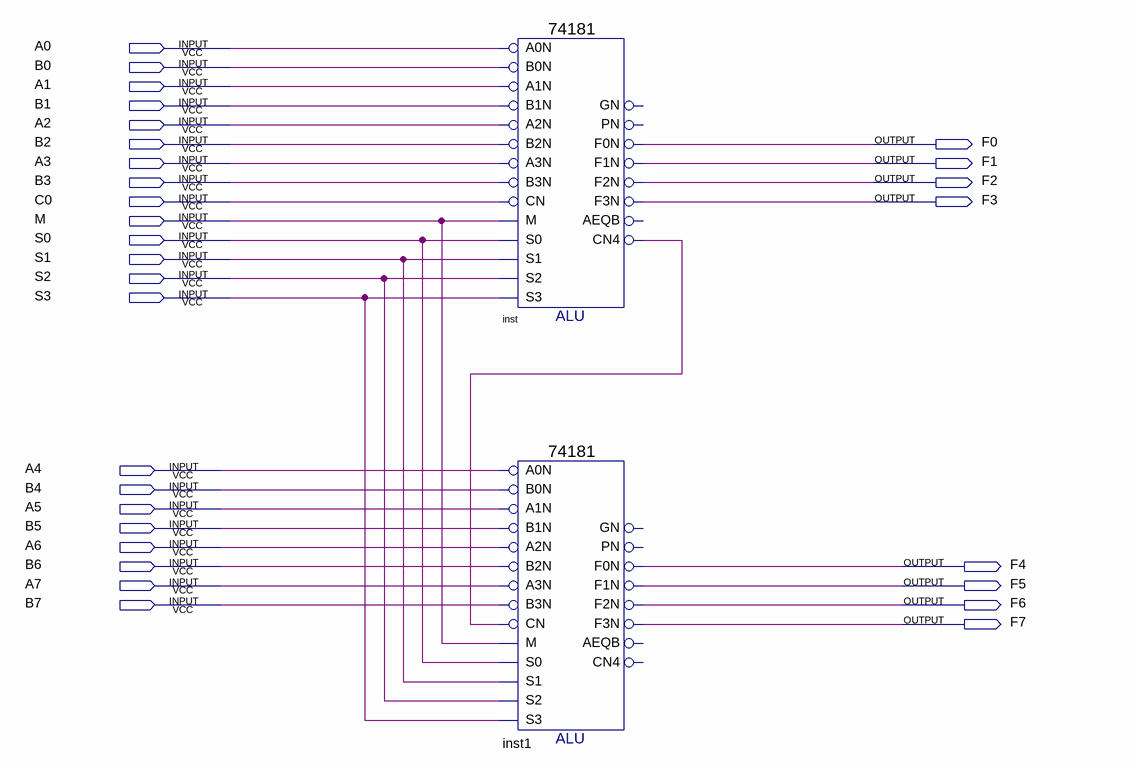
[diagram p0: schematic sheet]
// Quartus schematic alu.bdf as structural Verilog: 2 symbols, 30 pins
module alu (
  input  A0,
  input  B0,
  input  A1,
  input  B1,
  input  A2,
  input  B2,
  input  A3,
  input  B3,
  input  C0,
  input  M,
  input  S0,
  input  S1,
  input  S2,
  input  S3,
  input  A4,
  input  B4,
  input  A5,
  input  B5,
  input  A6,
  input  B6,
  input  A7,
  input  B7,
  output F0,
  output F1,
  output F2,
  output F3,
  output F4,
  output F5,
  output F6,
  output F7
);

  wire inst_cn4;

  \74181  inst (
    .B0N(B0), .A0N(A0), .A1N(A1), .B1N(B1), .A3N(A3), .B2N(B2), .A2N(A2), .M(M), .CN(C0), .B3N(B3), .S2(S2),
    .S1(S1), .S0(S0), .S3(S3), .F3N(F3), .F1N(F1), .F0N(F0), .CN4(inst_cn4), .F2N(F2));  // open: PN, GN, AEQB
  \74181  inst1 (
    .B0N(B4), .A0N(A4), .A1N(A5), .B1N(B5), .A3N(A7), .B2N(B6), .A2N(A6), .M(M), .CN(inst_cn4), .B3N(B7),
    .S2(S2), .S1(S1), .S0(S0), .S3(S3), .F3N(F7), .F1N(F5), .F0N(F4), .F2N(F6));  // open: PN, GN, AEQB, CN4
endmodule
